# Altium project NEMA_PANDORA.PrjPcb
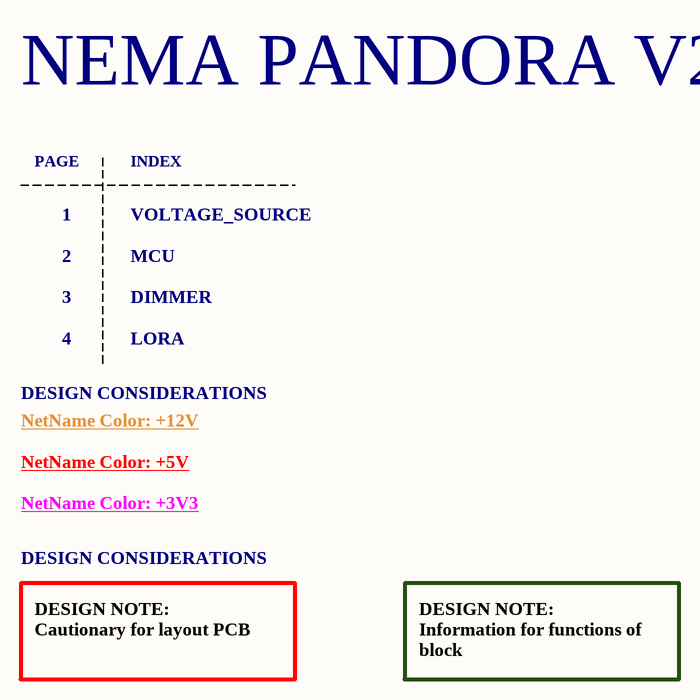
[diagram p0: COVER PAGE.SchDoc]
5 sheets, 77 parts. Net scope: global (net labels, ports and power ports of the same name join across sheets).
Board file: NEMA_PANDORA_PCB.PcbDoc
Sheets:
  COVER PAGE.SchDoc
  VOLTAGE_REGULATOR.SchDoc
  MCU.SchDoc
  DIMMER.SchDoc
  LORA.SchDoc

## Sheet COVER PAGE.SchDoc: NEMA PANDORA V2
size A4; DrawnBy: Nhatkhongbuon; SheetNumber: 1; SheetTotal: 5

### Notes on the sheet
- NEMA PANDORA V2
- PAGE
- INDEX
- 1
- VOLTAGE_SOURCE
- 2
- 3
- MCU
- DIMMER
- 4
- LORA
- DESIGN CONSIDERATIONS
- NetName Color: +12V
- NetName Color: +5V
- NetName Color: +3V3
- DESIGN NOTE:
  Cautionary for layout PCB
- DESIGN NOTE:
  Information for functions of block

## Sheet VOLTAGE_REGULATOR.SchDoc
size A; SheetNumber: 2; SheetTotal: 5
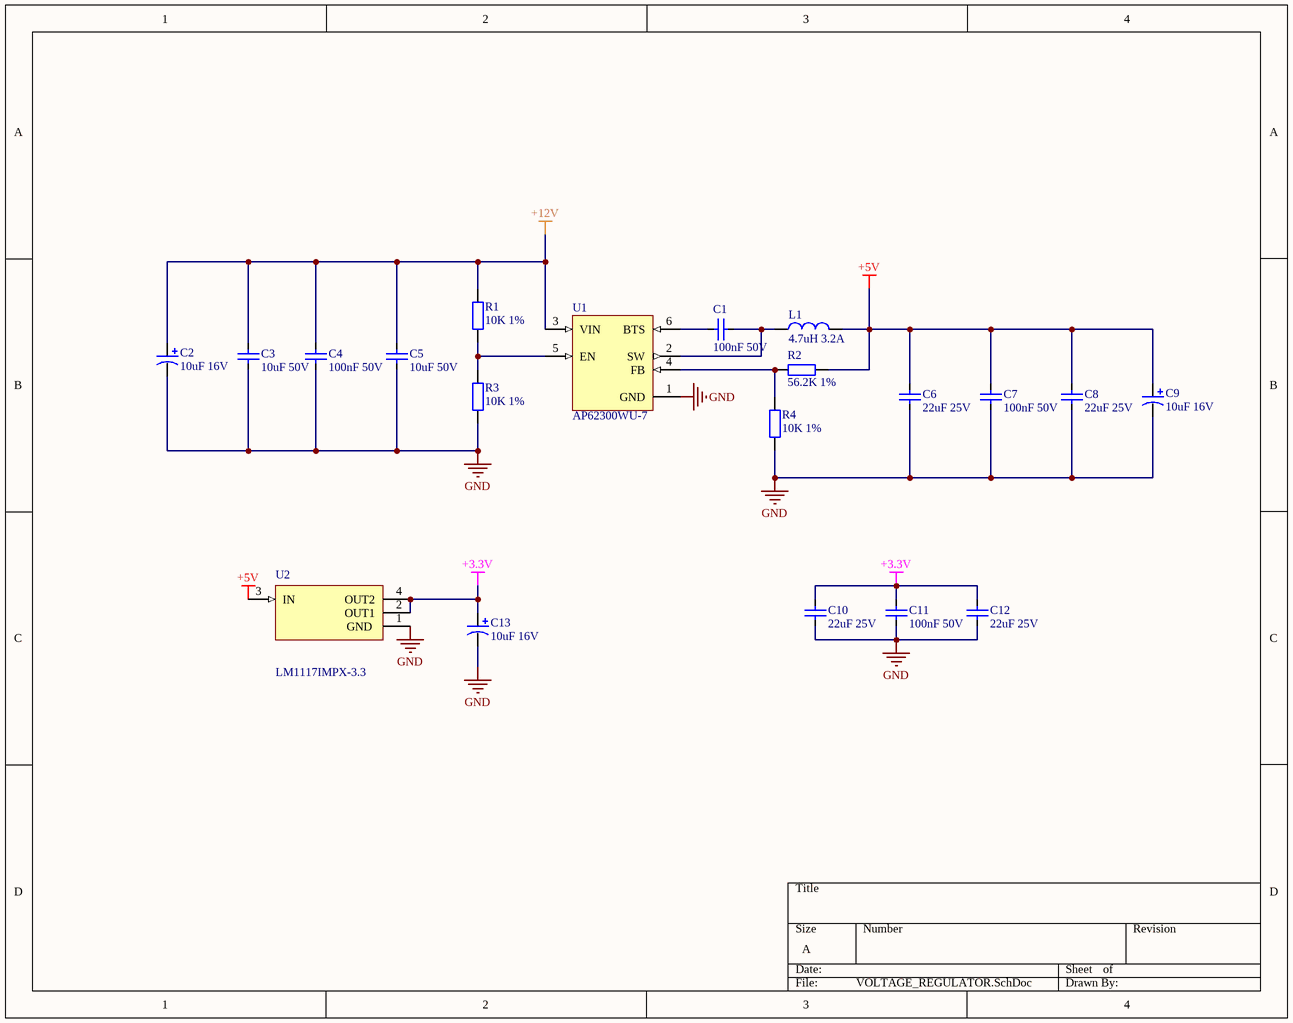
[diagram p1: VOLTAGE_REGULATOR.SchDoc]

### Parts
C1  100nF 50V  [CAP_SMD_0805]
C2  10uF 16V  [CAP-ALU-SMD-C]
C3  10uF 50V  [CAP_SMD_0805]
C4  100nF 50V  [CAP_SMD_0805]
C5  10uF 50V  [CAP_SMD_0805]
C6  22uF 25V  [CAP_SMD_0805]
C7  100nF 50V  [CAP_SMD_0805]
C8  22uF 25V  [CAP_SMD_0805]
C9  10uF 16V  [CAP-ALU-SMD-C]
C10  22uF 25V  [CAP_SMD_0805]
C11  100nF 50V  [CAP_SMD_0805]
C12  22uF 25V  [CAP_SMD_0805]
C13  10uF 16V  [CAP-ALU-SMD-C]
L1  4.7uH 3.2A  [L_5.5X5.2]
R1  10K 1%  [RES_SMD_0805]
R2  56.2K 1%  [RES_SMD_0805]
R3  10K 1%  [RES_SMD_0805]
R4  10K 1%  [RES_SMD_0805]
U1  AP62300WU-7  [SOT-23-6]
U2  LM1117IMPX-3.3  [SOT-223-4]

### Nets
+3.3V: C10.2 C11.2 C12.2 C13.1 U2.2(OUT1) U2.4(OUT2)
+5V: C6.2 C7.2 C8.2 C9.1 L1.2 R2.2 U2.3(IN)
+12V: C2.1 C3.2 C4.2 C5.2 R1.2 U1.3(VIN)
GND: C2.2 C3.1 C4.1 C5.1 C6.1 C7.1 C8.1 C9.2 C10.1 C11.1 C12.1 C13.2 R3.1 R4.1 U1.1(GND) U2.1(GND)
NetC1_1: C1.1 L1.1 U1.2(SW)
NetC1_2: C1.2 U1.6(BTS)
NetR1_1: R1.1 R3.2 U1.5(EN)
NetR2_1: R2.1 R4.2 U1.4(FB)

### Notes on the sheet
- (in symbol AP62300WU-7) /
- (in symbol LM1117IMPX-3.3/NOPB) /

### Library data of the parts
C1 C4 C7 C11 = C0805_MLCC_100nF_50V: 0.1 µF ±10% 50V Ceramic Capacitor X7R 0805 (2012 Metric); Manufacturer: YAGEO; Manufacture Part Number: CC0805KRX7R9BB104; Packaging: Cut Tape (CT); Link: https://www.digikey.cn/en/products/detail/yageo/CC0805KRX7R9BB104/302874; Price: $0.10
C2 C9 C13 = C_ALU_10uF_16V: 10 µF 16 V Aluminum - Polymer Capacitors Radial, Can - SMD 30mOhm 2000 Hrs @ 105°C; Manufacturer: Würth Elektronik; Manufacture Part Number: 875105359001; Packaging: Cut Tape (CT); Size code: C; Link: https://www.digikey.cn/en/products/detail/w%C3%BCrth-elektronik/875105359001/5147580; Price: $0.51
C3 C5 = C0805_MLCC_10uF_50V: 10 µF ±20% 50V Ceramic Capacitor X5R 0805 (2012 Metric); Manufacturer: Murata Electronics; Manufacture Part Number: GRM21BR61H106ME43L; Packaging: Cut Tape (CT); Link: https://www.digikey.cn/en/products/detail/murata-electronics/GRM21BR61H106ME43L/10326317; Price: $0.34
C6 C8 C10 C12 = C0805_MLCC_22uF_25V: 22 µF ±20% 25V Ceramic Capacitor X5R 0805 (2012 Metric); Manufacturer: Samsung Electro-Mechanics; Manufacture Part Number: CL21A226MAYNNNE; Packaging: Cut Tape (CT); Link: https://www.digikey.cn/en/products/detail/samsung-electro-mechanics/CL21A226MAYNNNE/10479857; Price: $0.25
L1 = L_SMD_4.7uH_3.2A: 4.7 µH Shielded Molded Inductor 3.2 A 81.3mOhm Max Nonstandard; Manufacturer: Vishay Dale; Manufacture Part Number: IHLP2020BZER4R7M11; Packaging: Cut Tape (CT); Link: https://www.digikey.com/en/products/detail/vishay-dale/IHLP2020BZER4R7M11/2025062; Price: $1.19
R1 R3 R4 = R0805_10K: 10 kOhms ±1% 0.125W, 1/8W Chip Resistor 0805 (2012 Metric) Moisture Resistant Thick Film; Manufacturer: YAGEO; Manufacture Part Number: RC0805FR-0710KL; Packaging: Cut Tape (CT); Price: $0.10; Link: https://www.digikey.cn/en/products/detail/yageo/RC0805FR-0710KL/727535
R2 = R0805_56.2K: 56.2 kOhms ±1% 0.125W, 1/8W Chip Resistor 0805 (2012 Metric) Moisture Resistant Thick Film; Manufacturer: YAGEO; Manufacture Part Number: RC0805FR-0756K2L; Packaging: Cut Tape (CT); Link: https://www.digikey.com/en/products/detail/yageo/RC0805FR-0756K2L/728035; Price: $0.10
U1 = AP62300WU-7: Buck Switching Regulator IC Positive Adjustable 0.8V 1 Output 3A SOT-23-6 Thin, TSOT-23-6; Manufacturer: Diodes Incorporated; Manufacture Part Number: AP62300WU-7; Packaging: Cut Tape (CT); Link: https://www.digikey.cn/en/products/detail/diodes-incorporated/AP62300WU-7/12324870?s=N4IgTCBcDaIIIAUBsYDMAGdB1AqiAugL5A; Price: $0.46
U2 = LM1117IMPX-3.3/NOPB: Linear Voltage Regulator IC Positive Fixed 1 Output 800mA SOT-223-4; Manufacturer: Texas Instruments; Manufacture Part Number: LM1117IMPX-3.3/NOPB; Packaging: Cut Tape (CT); Link: https://www.digikey.cn/en/products/detail/texas-instruments/LM1117IMPX-3-3-NOPB/1870906; Price: $1.14

## Sheet MCU.SchDoc
size A; Address1: Nhatkhongbuon; Address2: Nhatkhongbuon; Address3: Nhatkhongbuon; Address4: Nhatkhongbuon; SheetNumber: 3; SheetTotal: 5
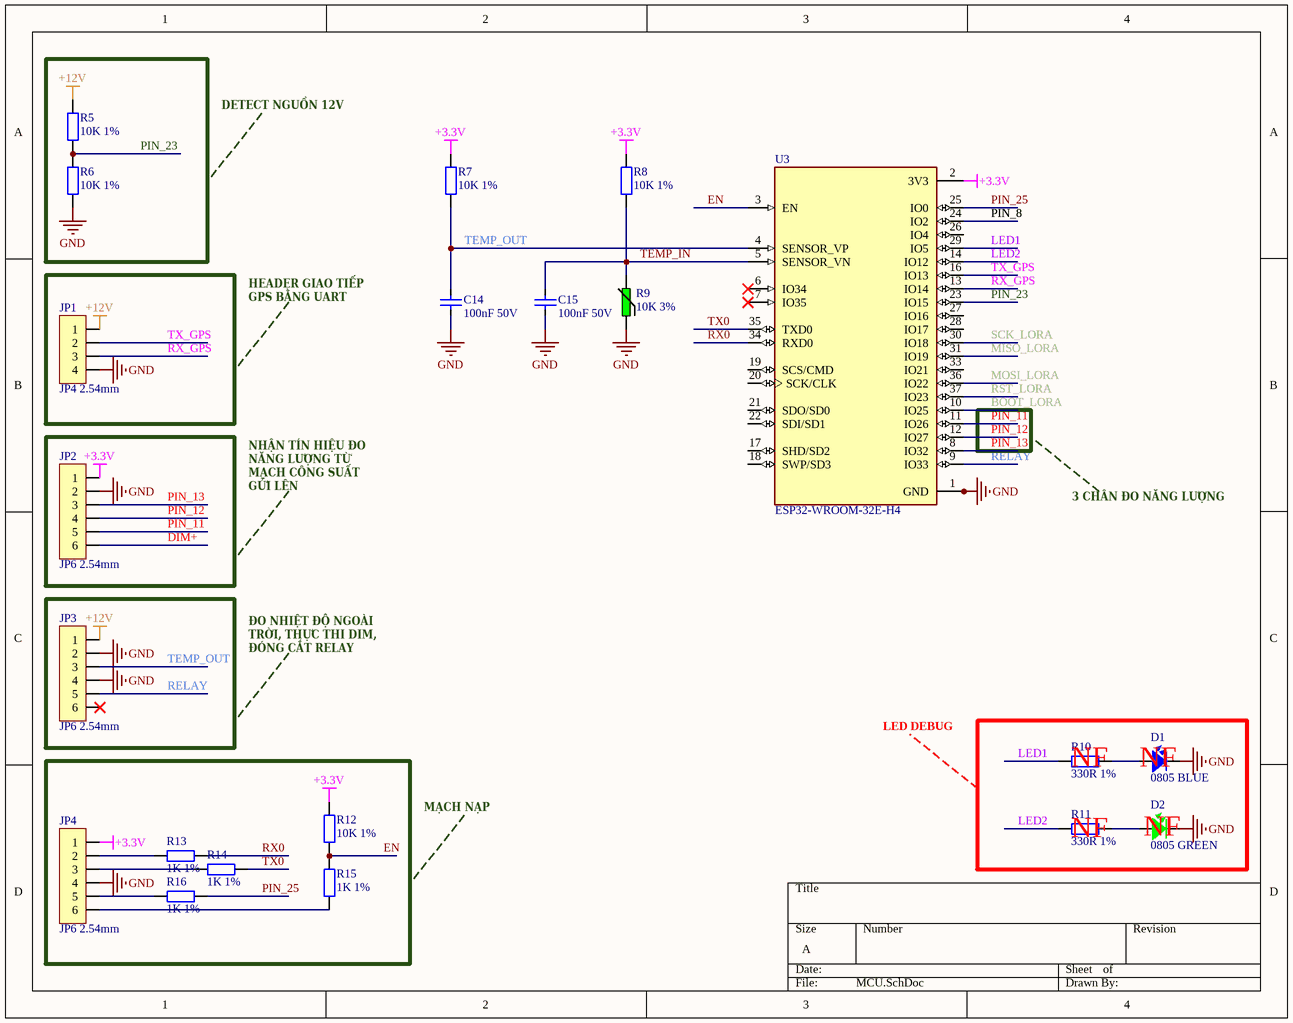
[diagram p2: MCU.SchDoc]

### Parts
C14  100nF 50V  [CAP_SMD_0805]
C15  100nF 50V  [CAP_SMD_0805]
D1  0805 BLUE  [LED-0805-Blue]
D2  0805 GREEN  [LED-0805-Green]
JP1  JP4 2.54mm  [JP4_M]
JP2  JP6 2.54mm  [JP6_M]
JP3  JP6 2.54mm  [JP6_M]
JP4  JP6 2.54mm  [JP6_M]
R5  10K 1%  [RES_SMD_0805]
R6  10K 1%  [RES_SMD_0805]
R7  10K 1%  [RES_SMD_0805]
R8  10K 1%  [RES_SMD_0805]
R9  10K 3%  [NTC_2.54.]
R10  330R 1%  [RES_SMD_0805]
R11  330R 1%  [RES_SMD_0805]
R12  10K 1%  [RES_SMD_0805]
R13  1K 1%  [RES_SMD_0805]
R14  1K 1%  [RES_SMD_0805]
R15  1K 1%  [RES_SMD_0805]
R16  1K 1%  [RES_SMD_0805]
U3  ESP32-WROOM-32E-H4  [ESP32-WROOM-32]

### Nets
+3.3V: JP2.1 JP4.1 R7.2 R8.2 R12.2 U3.2(3V3)
+12V: JP1.1 JP3.1 R5.2
GND: C14.1 C15.1 D1.2 D2.2 JP1.4 JP2.2 JP3.2 JP3.4 JP4.4 R6.1 R9.1 U3.1(GND) U3.15(GND) U3.38(GND) U3.39_1(GND) U3.39_2(GND) U3.39_3(GND) U3.39_4(GND) U3.39_5(GND) U3.39_6(GND) U3.39_7(GND) U3.39_8(GND) U3.39_9(GND) U3.39_10(GND) U3.39_11(GND) U3.39_12(GND) U3.39_13(GND) U3.39_14(GND) U3.39_15(GND) U3.39_16(GND) U3.39_17(GND) U3.39_18(GND) U3.39_19(GND) U3.39_20(GND) U3.39_21(GND)
BOOT_LORA: U3.10(IO25)
DIM+: JP2.6
EN: R12.1 R15.2 U3.3(EN)
LED1: R10.1 U3.29(IO5)
LED2: R11.1 U3.14(IO12)
MISO_LORA: U3.31(IO19)
MOSI_LORA: U3.36(IO22)
PIN_8: U3.24(IO2)
PIN_11: JP2.5 U3.11(IO26)
PIN_12: JP2.4 U3.12(IO27)
PIN_13: JP2.3 U3.8(IO32)
PIN_23: R5.1 R6.2 U3.23(IO15)
PIN_25: R16.2 U3.25(IO0)
RELAY: JP3.5 U3.9(IO33)
RST_LORA: U3.37(IO23)
RX0: R13.2 U3.34(RXD0)
RX_GPS: JP1.3 U3.13(IO14)
SCK_LORA: U3.30(IO18)
TEMP_IN: C15.2 R8.1 R9.2 U3.5(SENSOR_VN)
TEMP_OUT: C14.2 JP3.3 R7.1 U3.4(SENSOR_VP)
TX0: R14.2 U3.35(TXD0)
TX_GPS: JP1.2 U3.16(IO13)
NetD1_1: D1.1 R10.2
NetD2_1: D2.1 R11.2
NetJP4_2: JP4.2 R13.1
NetJP4_3: JP4.3 R14.1
NetJP4_5: JP4.5 R16.1
NetJP4_6: JP4.6 R15.1

Not connected (* = marked no-connect by the designer): JP3 6*; U3 6(IO34)* 7(IO35)* 17(SHD/SD2) 18(SWP/SD3) 19(SCS/CMD) 20(SCK/CLK) 21(SDO/SD0) 22(SDI/SD1) 26(IO4) 27(IO16) 28(IO17) 33(IO21)

### Notes on the sheet
- DETECT NGUỒN 12V
- HEADER GIAO TIẾP GPS BẰNG UART
- NHẬN TÍN HIỆU ĐO NĂNG LƯỢNG TỪ MẠCH CÔNG SUẤT GỬI LÊN
- 3 CHÂN ĐO NĂNG LƯỢNG
- ĐO NHIỆT ĐỘ NGOÀI TRỜI, THỰC THI DIM, ĐÓNG CẮT RELAY
- LED DEBUG
- (near R10) NF
- (near D1) NF
- MẠCH NẠP
- (near R11) NF
- (near D2) NF

### Library data of the parts
C14 C15 = C0805_MLCC_100nF_50V: as C1 on sheet VOLTAGE_REGULATOR; Packaging: Cut Tape (CT); Link: https://www.digikey.cn/en/products/detail/yageo/CC0805KRX7R9BB104/302874; Price: $0.10
D1 = LED_0805_BLUE: Blue 470nm LED Indication - Discrete 3.2V 0805 (2012 Metric); Manufacturer: Würth Elektronik; Manufacture Part Number: 150080BS75000; Packaging: Cut Tape (CT); Link: https://www.digikey.cn/en/products/detail/w%C3%BCrth-elektronik/150080BS75000/4489912; Price: $0.19
D2 = LED_0805_GREEN: Green 520nm LED Indication - Discrete 3.2V 0805 (2012 Metric); Manufacturer: Würth Elektronik; Manufacture Part Number: 150080GS75000; Packaging: Cut Tape (CT); Link: https://www.digikey.cn/en/products/detail/w%C3%BCrth-elektronik/150080GS75000/4489915; Price: $0.19
JP1 = JP4M: Connector Header Through Hole 4 position 0.100" (2.54mm); Manufacturer: Würth Elektronik; Manufacture Part Number: 61300411121; Packaging: Bulk; Link: https://www.digikey.cn/en/products/detail/w%C3%BCrth-elektronik/61300411121/4846827?s=N4IgTCBcDaIGwEYDMAGFAWBWwJAXQF8g; Price: $0.19
JP2-JP4 = JP6M: Connector Header Through Hole 6 position 0.100" (2.54mm); Manufacturer: Würth Elektronik; Manufacture Part Number: 61300611121; Packaging: Bulk; Link: https://www.digikey.cn/en/products/detail/w%C3%BCrth-elektronik/61300611121/4846833; Price: $0.35
R5-R8 R12 = R0805_10K: as R1 on sheet VOLTAGE_REGULATOR; Packaging: Cut Tape (CT); Price: $0.10; Link: https://www.digikey.cn/en/products/detail/yageo/RC0805FR-0710KL/727535
R9 = NTC_10K_: NTC Thermistor 10k Bead; Manufacturer: Vishay Beyschlag/Draloric/BC Components; Manufacture Part Number: NTCLE203E3103HB0; Packaging: Bulk; Link: https://www.digikey.com/en/products/detail/vishay-beyschlag-draloric-bc-components/NTCLE203E3103HB0/2230772; Price: $0.13
R10 R11 = R0805_330R: 330 Ohms ±1% 0.125W, 1/8W Chip Resistor 0805 (2012 Metric) Automotive AEC-Q200 Thick Film; Manufacturer: Stackpole Electronics Inc; Manufacture Part Number: RMCF0805FT330R; Packaging: Cut Tape (CT); Link: https://www.digikey.cn/en/products/detail/stackpole-electronics-inc/RMCF0805FT330R/1760484; Price: $0.10
R13-R16 = R0805_1K: 1 kOhms ±1% 0.125W, 1/8W Chip Resistor 0805 (2012 Metric) Moisture Resistant Thick Film; Manufacturer: YAGEO; Manufacture Part Number: 311-1.00KCRCT-ND; Packaging: Cut Tape (CT); Link: https://www.digikey.com/en/products/detail/yageo/RC0805FR-071KL/727444; Price: $0.10
U3 = ESP32-WROOM-32E-H4: Bluetooth, WiFi 802.11b/g/n, Bluetooth v4.2 +EDR, Class 1, 2 and 3 Transceiver Module 2.4GHz ~ 2.5GHz Integrated, Trace Surface Mount; Manufacturer: Espressif Systems; Manufacture Part Number: ESP32-WROOM-32E-H4; Packaging: Cut Tape (CT); Link: https://www.digikey.cn/en/products/detail/espressif-systems/ESP32-WROOM-32E-H4/12696413; Price: $2.68

## Sheet DIMMER.SchDoc
size A; SheetNumber: 4; SheetTotal: 5
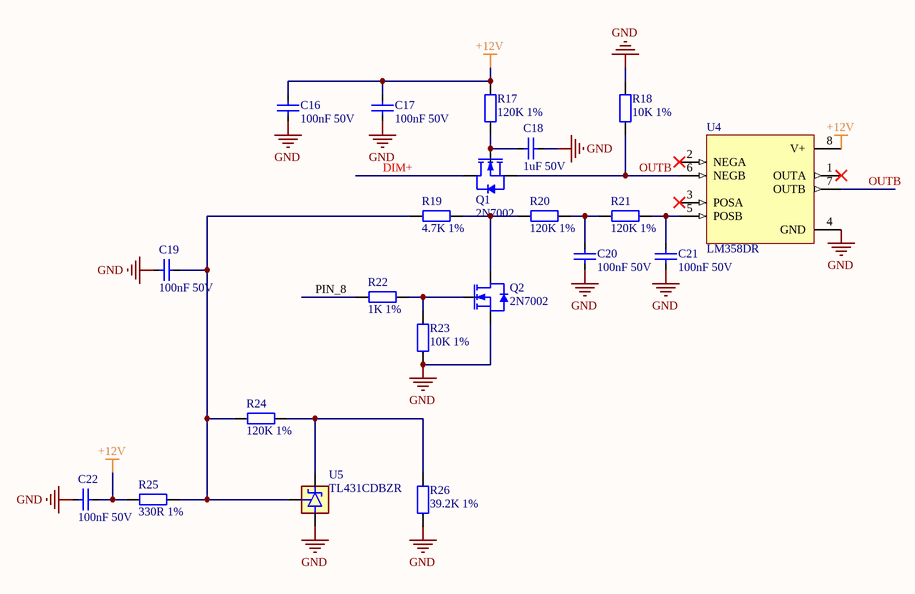
[diagram p3: DIMMER.SchDoc]

### Parts
C16  100nF 50V  [CAP_SMD_0805]
C17  100nF 50V  [CAP_SMD_0805]
C18  1uF 50V  [CAP_SMD_0805]
C19  100nF 50V  [CAP_SMD_0805]
C20  100nF 50V  [CAP_SMD_0805]
C21  100nF 50V  [CAP_SMD_0805]
C22  100nF 50V  [CAP_SMD_0805]
Q1  2N7002  [SOT-23-3]
Q2  2N7002  [SOT-23-3]
R17  120K 1%  [RES_SMD_0805]
R18  10K 1%  [RES_SMD_0805]
R19  4.7K 1%  [RES_SMD_0805]
R20  120K 1%  [RES_SMD_0805]
R21  120K 1%  [RES_SMD_0805]
R22  1K 1%  [RES_SMD_0805]
R23  10K 1%  [RES_SMD_0805]
R24  120K 1%  [RES_SMD_0805]
R25  330R 1%  [RES_SMD_0805]
R26  39.2K 1%  [RES_SMD_0805]
U4  LM358DR  [8 - SOIC]
U5  TL431CDBZR  [SOT-23-3]

### Nets
+12V: C16.2 C17.2 C22.2 R17.2 R25.1 U4.8(V+)
GND: C16.1 C17.1 C18.2 C19.1 C20.1 C21.1 C22.1 Q2.3(S) R18.2 R23.1 R26.1 U4.4(GND) U5.3(ANODE)
DIM+: Q1.2(D)
OUTB: Q1.3(S) R18.1 U4.6(NEGB) U4.7(OUTB)
PIN_8: R22.1
NetC18_1: C18.1 Q1.1(G) R17.1
NetC19_2: C19.2 R19.1 R24.1 R25.2 U5.2(REF)
NetC20_2: C20.2 R20.2 R21.1
NetC21_2: C21.2 R21.2 U4.5(POSB)
NetQ2_1: Q2.1(G) R22.2 R23.2
NetQ2_2: Q2.2(D) R19.2 R20.1
NetR24_2: R24.2 R26.2 U5.1(CATHODE)

Not connected (* = marked no-connect by the designer): U4 1(OUTA)* 2(NEGA)* 3(POSA)*

### Notes on the sheet
- (in symbol TL431CDBZR) /

### Library data of the parts
C16 C17 C19-C22 = C0805_MLCC_100nF_50V: as C1 on sheet VOLTAGE_REGULATOR; Packaging: Cut Tape (CT); Link: https://www.digikey.cn/en/products/detail/yageo/CC0805KRX7R9BB104/302874; Price: $0.10
C18 = C0805_MLCC_1uF_50V: 1 µF ±10% 50V Ceramic Capacitor X7R 0805 (2012 Metric); Manufacturer: Samsung Electro-Mechanics; Manufacture Part Number: CL21B105KBFNNNG; Packaging: Cut Tape (CT); Link: https://www.digikey.cn/en/products/detail/samsung-electro-mechanics/CL21B105KBFNNNG/3894467; Price: $0.11
Q1 Q2 = 2N7002: N-Channel 60 V 115mA (Ta) 200mW (Ta) Surface Mount SOT-23-3; Manufacturer: onsemi; Manufacture Part Number: 2N7002; Packaging: Cut Tape (CT); Link: https://www.digikey.com/en/products/detail/onsemi/2N7002/244664; Price: $0.45
R17 R20 R21 R24 = R0805_120K: 120 kOhms ±1% 0.125W, 1/8W Chip Resistor 0805 (2012 Metric) Moisture Resistant Thick Film; Manufacturer: YAGEO; Manufacture Part Number: RC0805FR-07120KL; Packaging: Cut Tape (CT); Link: https://www.digikey.com/en/products/detail/yageo/RC0805FR-07120KL/727576; Price: $0.10
R18 R23 = R0805_10K: as R1 on sheet VOLTAGE_REGULATOR; Packaging: Cut Tape (CT); Price: $0.10; Link: https://www.digikey.cn/en/products/detail/yageo/RC0805FR-0710KL/727535
R19 = R0805_4.7K: 4.7 kOhms ±1% 0.125W, 1/8W Chip Resistor 0805 (2012 Metric) Thick Film; Manufacturer: Vishay Dale; Manufacture Part Number: CRCW08054K70FKEAC; Packaging: Cut Tape (CT); Link: https://www.digikey.com/en/products/detail/vishay-dale/CRCW08054K70FKEAC/7928553; Price: $0.10
R22 = R0805_1K: as R13 on sheet MCU; Packaging: Cut Tape (CT); Link: https://www.digikey.com/en/products/detail/yageo/RC0805FR-071KL/727444; Price: $0.10
R25 = R0805_330R: as R10 on sheet MCU; Packaging: Cut Tape (CT); Link: https://www.digikey.cn/en/products/detail/stackpole-electronics-inc/RMCF0805FT330R/1760484; Price: $0.10
R26 = R0805_39.2K: 39.2 kOhms ±1% 0.125W, 1/8W Chip Resistor 0805 (2012 Metric) Moisture Resistant Thick Film; Manufacturer: YAGEO; Manufacture Part Number: RC0805FR-0739K2L; Packaging: Cut Tape (CT); Link: https://www.digikey.com/en/products/detail/yageo/RC0805FR-0739K2L/727901; Price: $0.10
U4 = LM358DR: General Purpose Amplifier 2 Circuit 8-SOIC; Manufacturer: Texas Instruments; Manufacture Part Number: LM358DR; Packaging: Cut Tape (CT); Link: https://www.digikey.cn/en/products/detail/texas-instruments/LM358DR/276658; Price: $0.41
U5 = TL431CDBZR: Shunt Voltage Reference IC Adjustable 2.495V 36 VV ±2.2% 100 mA SOT-23-3; Manufacturer: Texas Instruments; Manufacture Part Number: TL431CDBZR; Packaging: Cut Tape (CT); Link: https://www.digikey.com/en/products/detail/texas-instruments/TL431CDBZR/686858; Price: $0.47

## Sheet LORA.SchDoc
size A; SheetNumber: 5; SheetTotal: 5
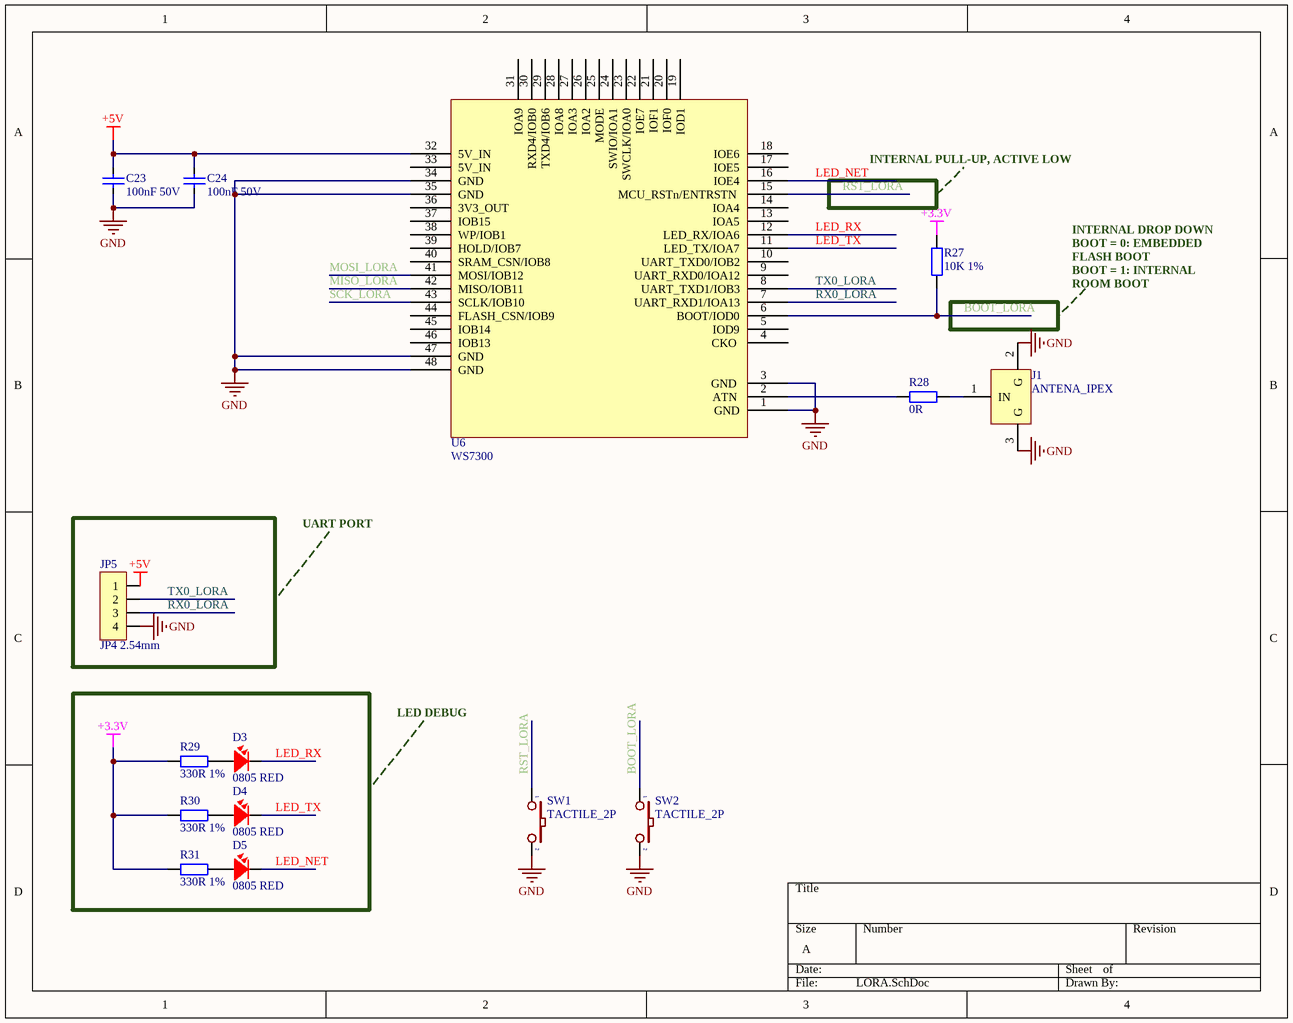
[diagram p4: LORA.SchDoc]

### Parts
C23  100nF 50V  [CAP_SMD_0805]
C24  100nF 50V  [CAP_SMD_0805]
D3  0805 RED  [LED-0805-Red]
D4  0805 RED  [LED-0805-Red]
D5  0805 RED  [LED-0805-Red]
J1  ANTENA_IPEX  [IPEX]
JP5  JP4 2.54mm  [JP4_M]
R27  10K 1%  [RES_SMD_0805]
R28  0R  [RES_SMD_0805]
R29  330R 1%  [RES_SMD_0805]
R30  330R 1%  [RES_SMD_0805]
R31  330R 1%  [RES_SMD_0805]
SW1  TACTILE_2P  [C&K BUTTON 2P]
SW2  TACTILE_2P  [C&K BUTTON 2P]
U6  WS7300  [WS7300-S]

### Nets
+3.3V: R27.2 R29.1 R30.1 R31.1
+5V: C23.2 C24.2 JP5.1 U6.32(5V_IN)
GND: C23.1 C24.1 J1.2(G) J1.3(G) JP5.4 SW1.2 SW2.2 U6.1(GND) U6.3(GND) U6.34(GND) U6.35(GND) U6.47(GND) U6.48(GND)
BOOT_LORA: R27.1 SW2.1 U6.6(BOOT/IOD0)
LED_NET: D5.2 U6.16(IOE4)
LED_RX: D3.2 U6.12(LED_RX/IOA6)
LED_TX: D4.2 U6.11(LED_TX/IOA7)
MISO_LORA : U6.42(MISO/IOB11)  [project net MISO_LORA]
MOSI_LORA : U6.41(MOSI/IOB12)  [project net MOSI_LORA]
RST_LORA: SW1.1 U6.15(MCU_RSTn/ENTRSTN)
RX0_LORA: JP5.3 U6.7(UART_RXD1/IOA13)
SCK_LORA: U6.43(SCLK/IOB10)
TX0_LORA: JP5.2 U6.8(UART_TXD1/IOB3)
NetD3_1: D3.1 R29.2
NetD4_1: D4.1 R30.2
NetD5_1: D5.1 R31.2
NetJ1_1: J1.1(IN) R28.2
NetR28_1: R28.1 U6.2(ATN)

Not connected (* = marked no-connect by the designer): U6 4(CKO_) 5(IOD9) 9(UART_RXD0/IOA12) 10(UART_TXD0/IOB2) 13(IOA5) 14(IOA4) 17(IOE5) 18(IOE6) 19(IOD1) 20(IOF0) 21(IOF1) 22(IOE7) 23(SWCLK/IOA0) 24(SWIO/IOA1) 25(MODE) 26(IOA2) 27(IOA3) 28(IOA8) 29(TXD4/IOB6) 30(RXD4/IOB0) 31(IOA9) 33(5V_IN) 36(3V3_OUT) 37(IOB15) 38(WP/IOB1) 39(HOLD/IOB7) 40(SRAM_CSN/IOB8) 44(FLASH_CSN/IOB9) 45(IOB14) 46(IOB13)

### Notes on the sheet
- INTERNAL PULL-UP, ACTIVE LOW
- INTERNAL DROP DOWN
  BOOT = 0: EMBEDDED FLASH BOOT
  BOOT = 1: INTERNAL ROOM BOOT
- UART PORT
- LED DEBUG

### Library data of the parts
C23 C24 = C0805_MLCC_100nF_50V: as C1 on sheet VOLTAGE_REGULATOR; Packaging: Cut Tape (CT); Link: https://www.digikey.cn/en/products/detail/yageo/CC0805KRX7R9BB104/302874; Price: $0.10
D3-D5 = LED_0805_RED: Red 625nm LED Indication - Discrete 2V 0805 (2012 Metric); Manufacturer: Würth Elektronik; Manufacture Part Number: 150080RS75000; Packaging: Cut Tape (CT); Link: https://www.digikey.cn/en/products/detail/w%C3%BCrth-elektronik/150080RS75000/4489918; Price: $0.19
J1 = ANTENA_IPEX: U.FL (UMCC), IPEX MHFI Connector Receptacle, Male Pin Surface Mount Solder; Manufacturer: I-PEX; Manufacture Part Number: 20279-001E-03; Packaging: Cut Tape (CT); Link: https://www.digikey.com/en/products/detail/i-pex/20279-001E-03/22108814; Price: $1.77
JP5 = JP4M: as JP1 on sheet MCU; Packaging: Bulk; Link: https://www.digikey.cn/en/products/detail/w%C3%BCrth-elektronik/61300411121/4846827?s=N4IgTCBcDaIGwEYDMAGFAWBWwJAXQF8g; Price: $0.19
R27 = R0805_10K: as R1 on sheet VOLTAGE_REGULATOR; Packaging: Cut Tape (CT); Price: $0.10; Link: https://www.digikey.cn/en/products/detail/yageo/RC0805FR-0710KL/727535
R28 = R0805_0R: 0 Ohms Jumper Chip Resistor 0805 (2012 Metric) Automotive AEC-Q200 Thick Film; Manufacturer: Vishay Dale; Manufacture Part Number: CRCW08050000Z0EA; Packaging: Cut Tape (CT); Link: https://www.digikey.cn/en/products/detail/vishay-dale/CRCW08050000Z0EA/1175125; Price: $0.10
R29-R31 = R0805_330R: as R10 on sheet MCU; Packaging: Cut Tape (CT); Link: https://www.digikey.cn/en/products/detail/stackpole-electronics-inc/RMCF0805FT330R/1760484; Price: $0.10
SW1 SW2 = SWITCH_TACTILE_2P: Tactile Switch SPST-NO Top Actuated Surface Mount; Manufacturer: C&K; Manufacture Part Number: PTS636 SM43 SMTR LFS; Packaging: Cut Tape (CT); Link: https://www.digikey.com/en/products/detail/c-k/PTS636-SM43-SMTR-LFS/10071723; Price: $0.19
U6 = WS7300: Wi-SUN wireless communication modules based on the VC7300BU chip from Lireda; Manufacturer: Lireda; Manufacture Part Number: WS7300

## Nets that join several sheets
+3.3V: VOLTAGE_REGULATOR (6 pins), MCU (6 pins), LORA (R27.2 R29.1 R30.1 R31.1)
+5V: VOLTAGE_REGULATOR (7 pins), LORA (C23.2 C24.2 JP5.1 U6.32)
+12V: VOLTAGE_REGULATOR (6 pins), MCU (JP1.1 JP3.1 R5.2), DIMMER (6 pins)
GND: VOLTAGE_REGULATOR (16 pins), MCU (35 pins), DIMMER (13 pins), LORA (13 pins)
BOOT_LORA: MCU (U3.10), LORA (R27.1 SW2.1 U6.6)
DIM+: MCU (JP2.6), DIMMER (Q1.2)
MISO_LORA: MCU (U3.31), LORA (U6.42)
MOSI_LORA: MCU (U3.36), LORA (U6.41)
PIN_8: MCU (U3.24), DIMMER (R22.1)
RST_LORA: MCU (U3.37), LORA (SW1.1 U6.15)
SCK_LORA: MCU (U3.30), LORA (U6.43)